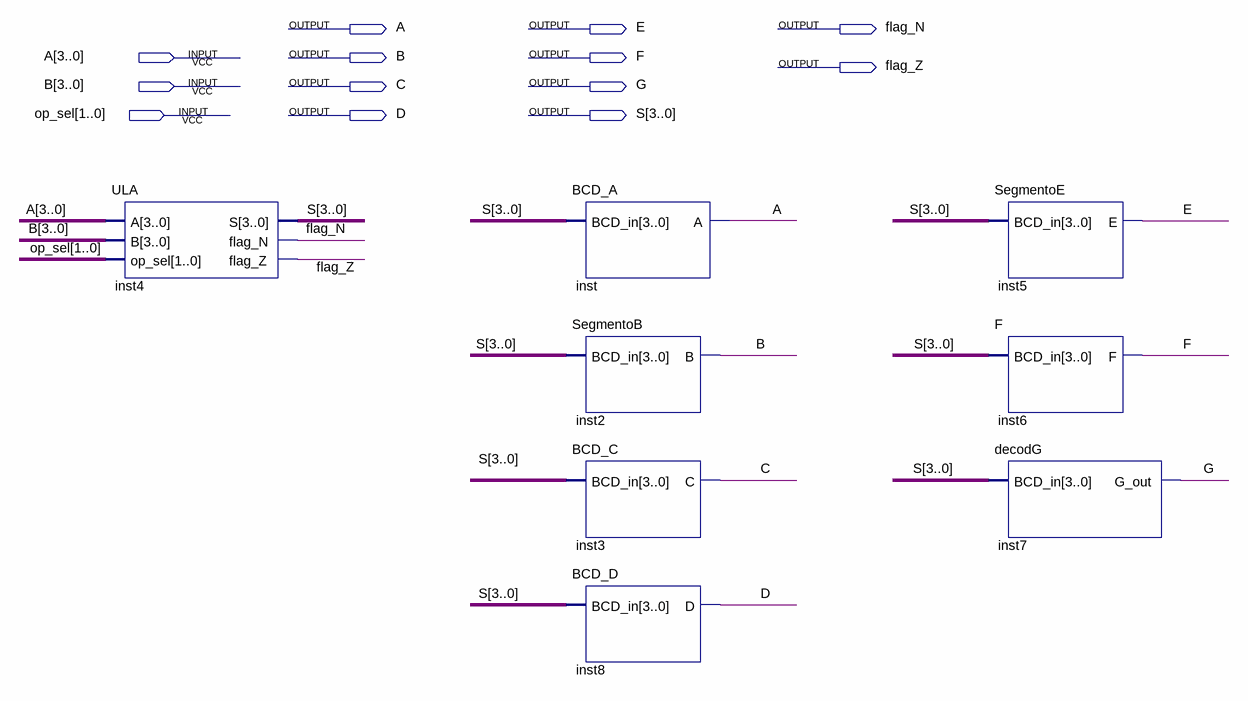
[diagram p0: schematic sheet]
// Quartus schematic display.bdf as structural Verilog: 8 symbols, 13 pins
module display (
  input  [3:0] A,
  input  [3:0] B,
  input  [1:0] op_sel,
  output A_1bit,
  output E,
  output flag_N,
  output B_1bit,
  output F,
  output flag_Z,
  output C,
  output G,
  output D,
  output [3:0] S
);

  ULA inst4 (.A(A), .B(B), .op_sel(op_sel), .S(S), .flag_N(flag_N), .flag_Z(flag_Z));
  BCD_A inst (.BCD_in(S), .A(A_1bit));
  SegmentoB inst2 (.BCD_in(S), .B(B_1bit));
  BCD_C inst3 (.BCD_in(S), .C(C));
  BCD_D inst8 (.BCD_in(S), .D(D));
  SegmentoE inst5 (.BCD_in(S), .E(E));
  F inst6 (.BCD_in(S), .F(F));
  decodG inst7 (.BCD_in(S), .G_out(G));
endmodule
